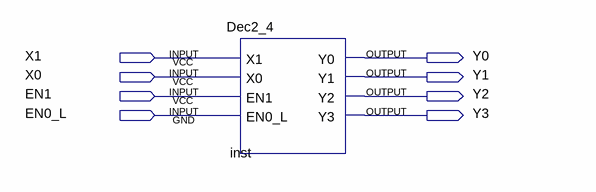
[diagram p0: schematic sheet]
// Quartus schematic DecoderDemo.bdf as structural Verilog: 1 symbols, 8 pins
module DecoderDemo (
  input  X1,
  input  X0,
  input  EN1,
  input  EN0_L,
  output Y0,
  output Y1,
  output Y2,
  output Y3
);

  Dec2_4 inst (.X1(X1), .X0(X0), .EN1(EN1), .EN0_L(EN0_L), .Y0(Y0), .Y1(Y1), .Y2(Y2), .Y3(Y3));
endmodule
